# EAGLE design MiSTerDualshock (EAGLE 6.6.0)
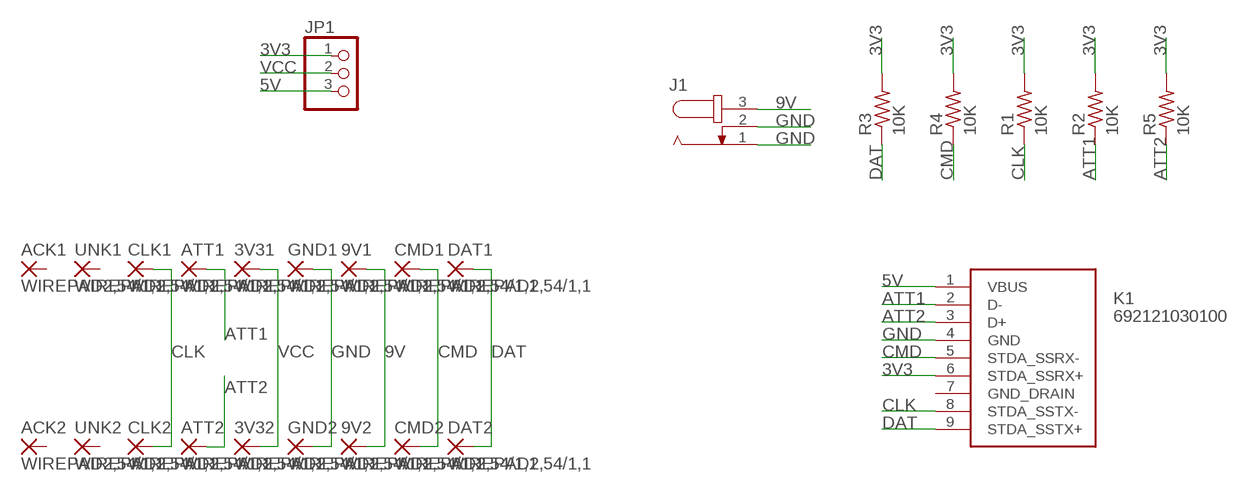
[diagram p0: schematic, sheet 1]

## Parts
3V31  WIREPAD2,54/1,1  [2,54/1,1]
3V32  WIREPAD2,54/1,1  [2,54/1,1]
9V1  WIREPAD2,54/1,1  [2,54/1,1]
9V2  WIREPAD2,54/1,1  [2,54/1,1]
ACK1  WIREPAD2,54/1,1  [2,54/1,1]
ACK2  WIREPAD2,54/1,1  [2,54/1,1]
ATT1  WIREPAD2,54/1,1  [2,54/1,1]
ATT2  WIREPAD2,54/1,1  [2,54/1,1]
CLK1  WIREPAD2,54/1,1  [2,54/1,1]
CLK2  WIREPAD2,54/1,1  [2,54/1,1]
CMD1  WIREPAD2,54/1,1  [2,54/1,1]
CMD2  WIREPAD2,54/1,1  [2,54/1,1]
DAT1  WIREPAD2,54/1,1  [2,54/1,1]
DAT2  WIREPAD2,54/1,1  [2,54/1,1]
GND1  WIREPAD2,54/1,1  [2,54/1,1]
GND2  WIREPAD2,54/1,1  [2,54/1,1]
J1  JACK-PLUG1  [SPC4078]
JP1  PINHD-1X3  [1X03]
K1  692121030100  [692121030100]
R1  10K  R-US_0207/10  [0207/10]
R2  10K  R-US_0207/10  [0207/10]
R3  10K  R-US_0207/10  [0207/10]
R4  10K  R-US_0207/10  [0207/10]
R5  10K  R-US_0207/10  [0207/10]
UNK1  WIREPAD2,54/1,1  [2,54/1,1]
UNK2  WIREPAD2,54/1,1  [2,54/1,1]

## Nets
3V3: JP1.1 K1.6(STDA_SSRX+) R1.2 R2.2 R3.2 R4.2 R5.2
5V: JP1.3 K1.1(VBUS)
9V: 9V1.1(P) 9V2.1(P) J1.3
ATT1: ATT1.1(P) K1.2(D-) R2.1
ATT2: ATT2.1(P) K1.3(D+) R5.1
CLK: CLK1.1(P) CLK2.1(P) K1.8(STDA_SSTX-) R1.1
CMD: CMD1.1(P) CMD2.1(P) K1.5(STDA_SSRX-) R4.1
DAT: DAT1.1(P) DAT2.1(P) K1.9(STDA_SSTX+) R3.1
GND: GND1.1(P) GND2.1(P) J1.1 J1.2 K1.4(GND)
VCC: 3V31.1(P) 3V32.1(P) JP1.2
Unconnected: ACK1.1(P) ACK2.1(P) K1.7(GND_DRAIN) UNK1.1(P) UNK2.1(P)

## Library data of the parts
3V31 3V32 9V1 9V2 ACK1 ACK2 ATT1 ATT2 CLK1 CLK2 CMD1 CMD2 DAT1 DAT2 GND1 GND2 UNK1 UNK2 = wirepad:WIREPAD: Wire PAD connect wire on PCB
J1 = con-jack:JACK-PLUG: DC POWER JACK Power Jack, DC, Right Angle, Through Hole, Rated 5A at 16VDC, PC Terminals Distributor: Farnell (www.Farnell.de) Drawing: 84N1161.pdf / 84N1162.pdf Manufacturer: SPC Technology (www.spctechnology.com) Type: SPC4077 / SPC 4078; OC_FARNELL: unknown; OC_NEWARK: unknown
JP1 = pinhead:PINHD-1X3: PIN HEADER
K1 = wuerth:692121030100: WR-COM USB 3.0 HORIZONTAL TYPE A
R1-R5 = resistor:R-US_: RESISTOR, American symbol

## Board
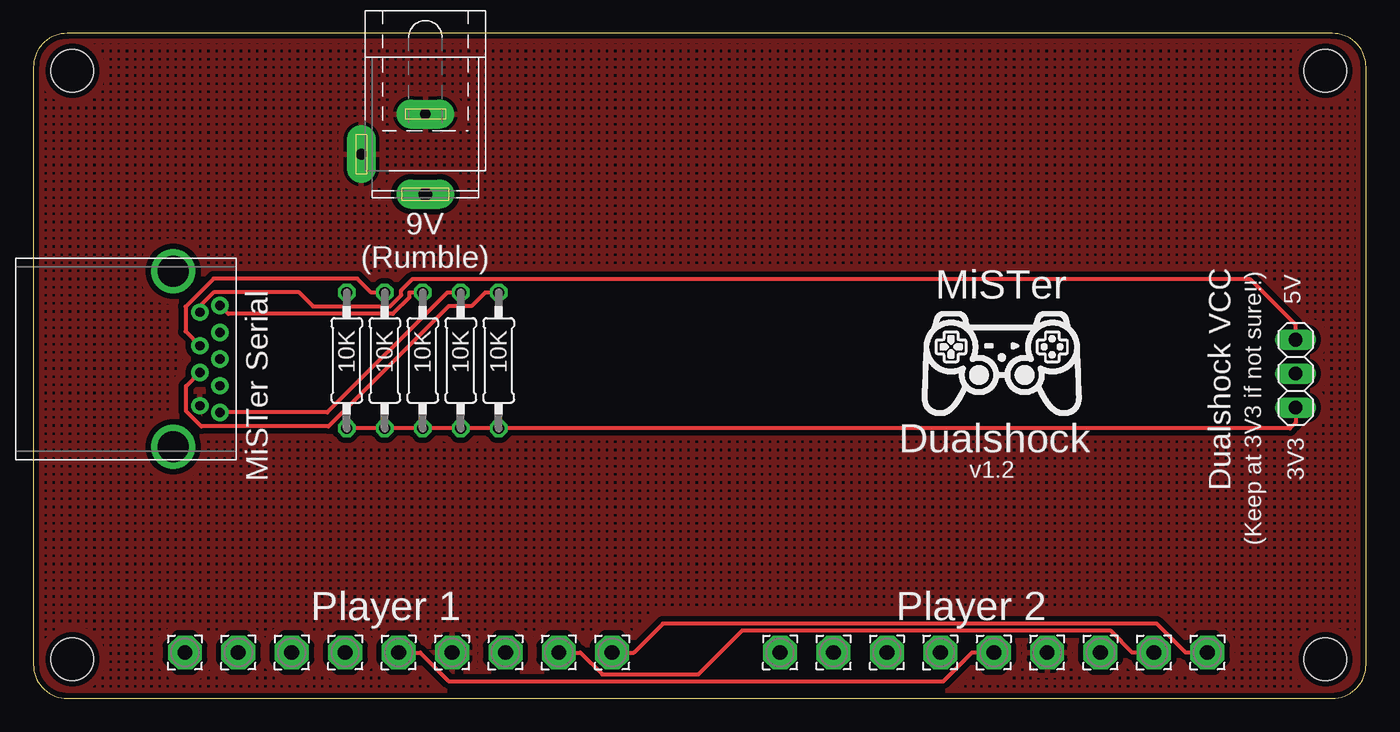
[diagram p1: board, top side]
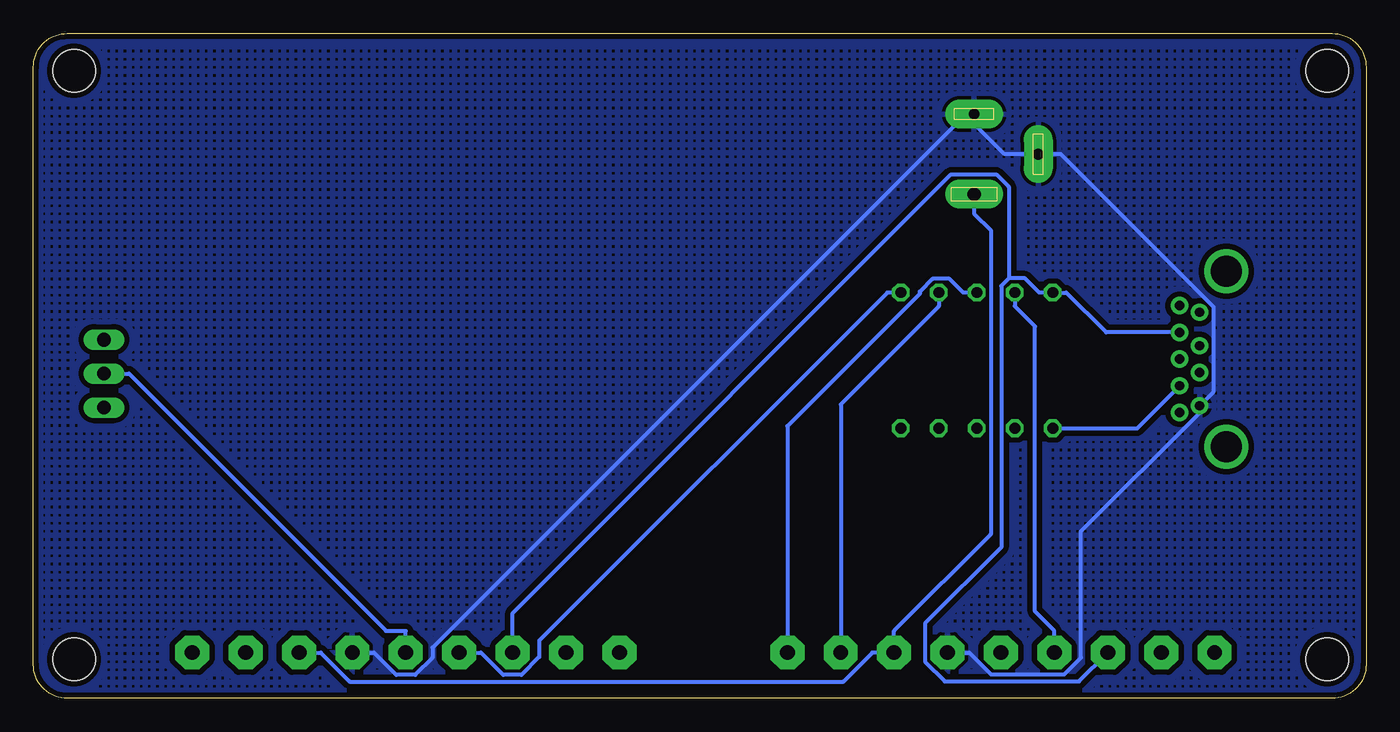
[diagram p2: board, bottom side, seen from below]

Size 99.82 x 49.78 mm. Coordinates in mm from the lower left corner, seen from the top.
Outline: 0,47.24 0,2.54 arc90 2.54,0 97.28,0 arc90 99.82,2.54 99.82,47.24 arc90 97.28,49.78 2.54,49.78 arc90 0,47.24
Copper layers (1*16): Top 0.035mm / dielectric 1.5mm / Bottom 0.035mm
Design rules "SeeedStudio_2layer_DRU_no_angle_20140221": minimum track width 6mil, minimum drill 12mil, track to track 6mil, track to pad 6mil, pad to pad 6mil, via to via 6mil, smd to smd 0mil, copper to edge 10mil, drill to drill 10mil, minimum pad ring 10mil, minimum via ring 6mil, stop-mask expansion 2mil, vias tented up to drill 100mil, thermal gap 10mil
Holes 3.2 mm at 2.92,46.99 2.92,2.92 96.77,46.99 96.77,2.92

### Footprints (pad centres in the part's own frame; a part is rotated, then mirrored left to right if it is on the bottom)
2,54/1,1 = drill 1.118 pad 2.54 octagon: 1 0,0
SPC4078 = drill 0.8 pad 2.184 long: 1 -3,0; 2 0,-4.8 | drill 1 pad 2.184 long: 3 3,0
1X03 = drill 1.016 long: 1 -2.54,0; 2 0,0; 3 2.54,0
692121030100 = drill 0.7 pad 1.3: 1 3.5,1.5; 2 1,1.5; 3 -1,1.5; 4 -3.5,1.5; 5 -4,0; 6 -2,0; 7 0,0; 8 2,0; 9 4,0 | drill 2.3 pad 3.3: Z1 -6.57,3.5; Z2 6.57,3.5
0207/10 = drill 0.813 octagon: 1 -5.08,0; 2 5.08,0

### Placement (x,y rotation side)
3V31  27.35,3.43 0 top
3V32  71.93,3.43 0 top
9V1  35.35,3.43 0 top
9V2  79.93,3.43 0 top
ACK1  11.35,3.43 0 top
ACK2  55.93,3.43 0 top
ATT1  23.35,3.43 0 top
ATT2  67.93,3.43 0 top
CLK1  19.35,3.43 0 top
CLK2  63.93,3.43 0 top
CMD1  39.35,3.43 0 top
CMD2  83.93,3.43 0 top
DAT1  43.35,3.43 0 top
DAT2  87.93,3.43 0 top
GND1  31.35,3.43 0 top
GND2  75.93,3.43 0 top
J1  29.36,40.74 270 top
JP1  94.54,24.31 90 top
K1  13.97,25.4 90 top
R1  23.47,25.3 270 top
R2  26.31,25.3 270 top
R3  29.16,25.3 270 top
R4  32,25.3 270 top
R5  34.85,25.3 270 top
UNK1  15.35,3.43 0 top
UNK2  59.93,3.43 0 top

### Tracks (layer width: path | path; a pad name or v marks a point on that pad's centre or on a via)
3V3
  Top 0.305: R1.2 R2.2 R3.2 R4.2 R5.2 94.11,20.22 94.54,20.65 JP1.1
  Bottom 0.305: R1.2 17.15,20.22 K1.6
5V
  Top 0.305: JP1.3 94.54,27.96 91.11,31.4 28.41,31.4 27.56,30.54 27.56,30.18 26.72,29.34 20.94,29.34 19.86,30.42 13.55,30.42 12.47,29.34 K1.1
9V
  Bottom 0.305: 9V2.1 78.31,3.43 76.13,1.25 39.16,1.25 36.98,3.43 9V1.1 35.35,5.05 28.12,12.29 28.12,35.05 29.36,36.29 J1.3
ATT1
  Top 0.305: R2.1 25.3,30.38 24.26,31.42 13.49,31.42 11.4,29.33 11.4,27.47 K1.2
  Bottom 0.305: R2.1 26.31,29.36 24.8,27.85 24.8,6.51 23.35,5.05 ATT1.1
ATT2
  Top 0.305: R5.1 33.83,30.38 32.82,29.36 31.11,29.36 22.11,20.37 12.57,20.37 11.44,21.5 11.44,23.37 K1.3
  Bottom 0.305: ATT2.1 66.31,3.43 64.64,1.76 63.27,1.76 61.93,3.1 61.93,4.31 35.87,30.38 R5.1
CLK
  Bottom 0.305: K1.8 19.48,27.4 22.45,30.38 R1.1 24.49,30.38 25.55,31.44 26.77,31.44 | 26.77,31.44 27.33,30.88 27.33,11.31 33.04,5.6 33.04,2.75 31.56,1.27 21.51,1.27 CLK1.1 | CLK2.1 63.93,6.39 31.09,39.23 27.7,39.23 26.77,38.3 26.77,31.44
CMD
  Top 0.305: R4.1 30.99,30.38 22.01,21.4 K1.5 | CMD2.1 82.31,3.43 80.65,5.08 53.1,5.08 49.8,1.78 42.62,1.78 40.98,3.43 CMD1.1
  Bottom 0.305: CMD1.1 39.35,22.01 32,29.36 R4.1
DAT
  Top 0.305: R3.1 28.14,30.38 28.14,30 26.92,28.78 14.59,28.78 K1.9 | DAT1.1 44.98,3.43 47.14,5.59 84.14,5.59 86.31,3.43 DAT2.1
  Bottom 0.305: R3.1 30.18,30.38 31.21,31.41 32.47,31.41 33.43,30.45 33.43,30.3 43.35,20.38 DAT1.1
GND
  Bottom 0.305: 29.36,43.02 27.09,40.74 J1.2 22.87,40.74 11.41,29.28 11.41,22.96 K1.4 12.47,21.4 21.35,12.51 21.35,3.05 22.6,1.8 28.1,1.8 29.73,3.43 GND1.1 | GND2.1 74.31,3.43 72.64,1.76 71.21,1.76 69.93,3.04 69.93,3.79 30.7,43.02 29.36,43.02 | J1.1 29.36,43.02
  pour Bottom (isolate 0.406, hatched): -0.18,49.89 99.85,49.89 99.85,-0.2 -0.18,-0.2
  pour Top (isolate 0.406, hatched): -0.18,49.89 99.85,49.89 99.85,-0.38 -0.18,-0.38
VCC
  Top 0.305: 3V31.1 28.98,3.43 31.15,1.26 68.13,1.26 70.31,3.43 3V32.1
  Bottom 0.305: 3V32.1 71.93,5.05 73.41,5.05 92.66,24.31 JP1.2

### Text on the board
tPlace: 9V / (Rumble) | MiSTer | 5V | Dualshock | MiSTer Serial | v1.2 | Dualshock VCC | 3V3 | (Keep at 3V3 if not sure!!) | Player 1 | Player 2 | /Users/bruno/Downloads/dualshock.bmp